# Altium schematic sheet Power Supply.SchDoc
size A4; SheetNumber: 2; SheetTotal: 5
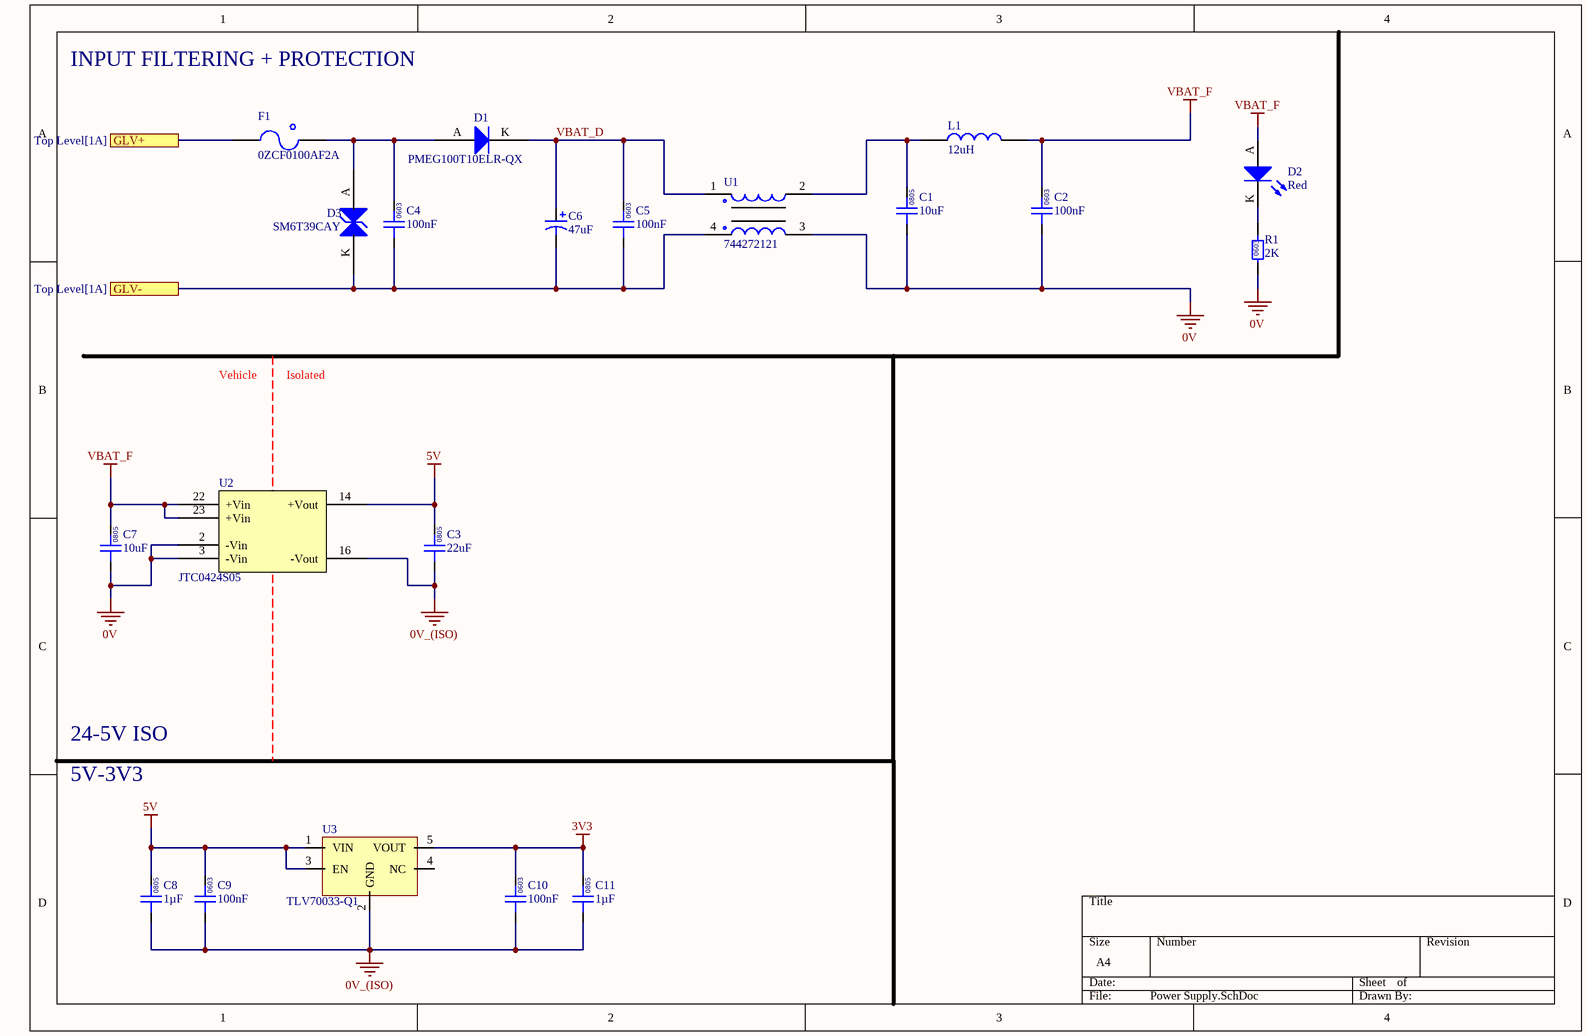
[diagram p0: Power Supply.SchDoc]

## Parts
C1  10uF  [0805]
C2  100nF  [0603]
C3  22uF  [0805]
C4  100nF  [0603]
C5  100nF  [0603]
C6  47uF  [CHEMI-CON ELCO]
C7  10uF  [0805]
C8  1µF  [0805]
C9  100nF  [0603]
C10  100nF  [0603]
C11  1µF  [0805]
D1  PMEG100T10ELR-QX  [SODFL350X110-2N]
D2  Red  [0805 LED]
D3  SM6T39CAY  [SM6T39CAY-Footprint-1]
F1  0ZCF0100AF2A  [2920]
L1  12uH  [1812]
R1  2K  [0603]
U1  744272121  [Wurth 4-PC Pad]
U2  JTC0424S05  [24-DIP Module, 7 Leads]
U3  TLV70033-Q1  [TI SOT-23-5]

## Ports
GLV+ (see Top Level[1A]), GLV- (see Top Level[1A])

## Nets
0V: C1.1 C2.1 C7.1 R1.1 U1.3 U2.2(-Vin) U2.3(-Vin)
0V_(ISO): C3.1 C8.1 C9.1 C10.1 C11.1 U2.16(-Vout) U3.2(GND)
3V3: C10.2 C11.2 U3.5(VOUT)
5V: C3.2 C8.2 C9.2 U2.14(+Vout) U3.1(VIN) U3.3(EN)
VBAT_F: C2.2 C7.2 D2.A L1.1 U2.22(+Vin) U2.23(+Vin)
GLV+: F1.1 ; port GLV+
GLV-: C4.1 C5.1 C6.1 D3.K U1.4 ; port GLV-
VBAT_D: C5.2 C6.2 D1.K U1.1
NetC1_2: C1.2 L1.2 U1.2
NetC4_2: C4.2 D1.A D3.A F1.2
NetD2_K: D2.K R1.2

Not connected (* = marked no-connect by the designer): U3 4(NC)

## Notes on the sheet
- INPUT FILTERING + PROTECTION
- Vehicle
- Isolated
- 24-5V ISO
- 5V-3V3
- (in symbol GCM21BR71H105KA03L) 0805
- (in symbol GCM188L81H104KA57D) 0603
- (in symbol GRM21BR6YA106KE43L) 0805
- (in symbol GRM21BR61A226ME51L) 0805
- (in symbol RC0603FR-072KL) 0603

## Library data of the parts
C1 C7 = GRM21BR6YA106KE43L: Manufacturer: muRata; Rated Voltage: 50V; Tolerance: 10%; Material: MLCC; Temperature Rating: X5R; Part Number: GRM21BR6YA106KE43L; Value: 10uF; Digikey Part Number: 490-10514-6-ND
C2 C4 C5 C9 C10 = GCM188L81H104KA57D: Manufacturer: muRata; Rated Voltage: 50V; Tolerance: ±10%; Material: MLCC; Temperature Rating: X8L; Part Number: GCM188L81H104KA57D; Value: 100nF; Digikey Part Number: 490-6049-1-ND
C3 = GRM21BR61A226ME51L: Manufacturer: muRata; Rated Voltage: 10V; Tolerance: 20%; Material: MLCC; Temperature Rating: X5R; Part Number: GRM21BR61A226ME51L; Value: 22uF; Digikey Part Number: 490-10511-1-ND
C6 = HHXA350ARA470MF61G: Part Number: HHXA350ARA470MF61G
C8 C11 = GCM21BR71H105KA03L: Manufacturer: muRata; Rated Voltage: 50V; Tolerance: ±10%; Material: MLCC; Temperature Rating: X7R; Part Number: GCM21BR71H105KA03L; Value: 1µF; Digikey Part Number: 490-10675-1-ND
D1 = CMP-004-00005-4: Diode 100 V 1A Surface Mount SOD-123W
D2 = SML-210LTT86: Red LED Indication - Discrete 1.75V 0805 (2012 Metric); Manufacturer: ROHM Semiconductor; Part Number: SML-210LTT86; Colour: Red; Digikey Part Number: 511-1286-1-ND
D3 = CMP-004-00003-4: TVS Diode Single Bi-Dir 33.3V 600W Automotive 2-Pin SMB T/R / TVS DIODE 33.3VWM 69.7VC SMB; Peak Pulse Current: 57A; Polarity: Bidirectional; Min Breakdown Voltage: 37.1V; Test Current: 1mA; Number of Elements: 1; Operating Supply Voltage: 30V; Diode Type: ZENER; Clamping Voltage: 53.9V; Leakage Current: 200nA; Power Line Protection: No; Max Surge Current: 11.1A; Max Breakdown Voltage: 41V; Breakdown Voltage: 39V; Max Power Dissipation: 600W; Radiation Hardening: No; Resistor Type: Zener; Termination: SMD/SMT; REACH SVHC: No SVHC; Reverse Breakdown Voltage: 37.1V; Max Operating Temperature: 150°C; Min Operating Temperature: -55°C; Element Configuration: Single; Length: 4.6mm; Case/Package: DO-214AA; Reverse Standoff Voltage: 33.3V; Number of Bidirectional Channels: 1; Number of Pins: 2; Direction: Bidirectional; Mount: Surface Mount; Package Quantity: 1; Width: 3.95mm; RoHS Compliant: Yes; Number of Channels: 1; Packaging: Tape and Reel; Max Reverse Leakage Current: 200nA; Peak Pulse Power: 600W; Height: 2.45mm; Series: Automotive, AEC-Q101, SM6TY, TRANSIL™
F1 = 0ZCF0100AF2A: PTC RESET FUSE 60V 1A 292; Manufacturer: Littelfuse Inc.; Part Number: 0ZCF0100AF2A; Digikey Part Number: 507-2070-1-ND; Digikey Link: https://www.digikey.com/product-detail/en/bel-fuse-inc/0ZCF0100AF2A/507-2070-1-ND/6210547
L1 = RLS-126: Manufacturer: Recom; Tolerance: 0.2; Impedance: 230mOhm; Rated Current: 0.8 A; Material: Wirewound; Part Number: RLS-126; Value: 12uH; Digikey Part Number: 945-3429-ND
R1 = RC0603FR-072KL: Manufacturer: YAGEO; Tolerance: 0.01; Rated Power: 0.1W; Part Number: RC0603FR-072KL; Value: 2K; Digikey Part Number: 311-2.00KHRCT-ND; Material: FR-07
U1 = 744272121: Manufacturer: Wurth Electronics Inc; Value: 120uH @ 100kHz; Impedance: 460 Ohms @ 30MHz; Rated Current: 2.5 A; Part Number: 744272121; Material: Wirewound; Digikey Part Number: 732-1489-1-ND
U2 = JTC0424S05: DC DC CONVERTER 5V 4W; Manufacturer: XP Power; Input Voltage: 9V-36V; Efficiency: 0.79; Isolation: Isolated; Part Number: JTC0424S05; Output Voltage: 5V; Output Power: 4W; Digikey Part Number: JTC0424S05-ND; Digikey Link: https://www.digikey.com/products/en?keywords=%20JTC0424S05
U3 = TLV70033-Q1: IC REG LINEAR 3.3V 200MA SOT23-5; Manufacturer: Texas Instruments; Input Voltage: 2 to 5.5 V; Output Current: 0.2 A; Part Number: TLV70033-Q1; Output Voltage: 3.3 V; Digikey Part Number: 296-27780-1-ND